# Altium schematic sheet motorEncoder.SchDoc
size A
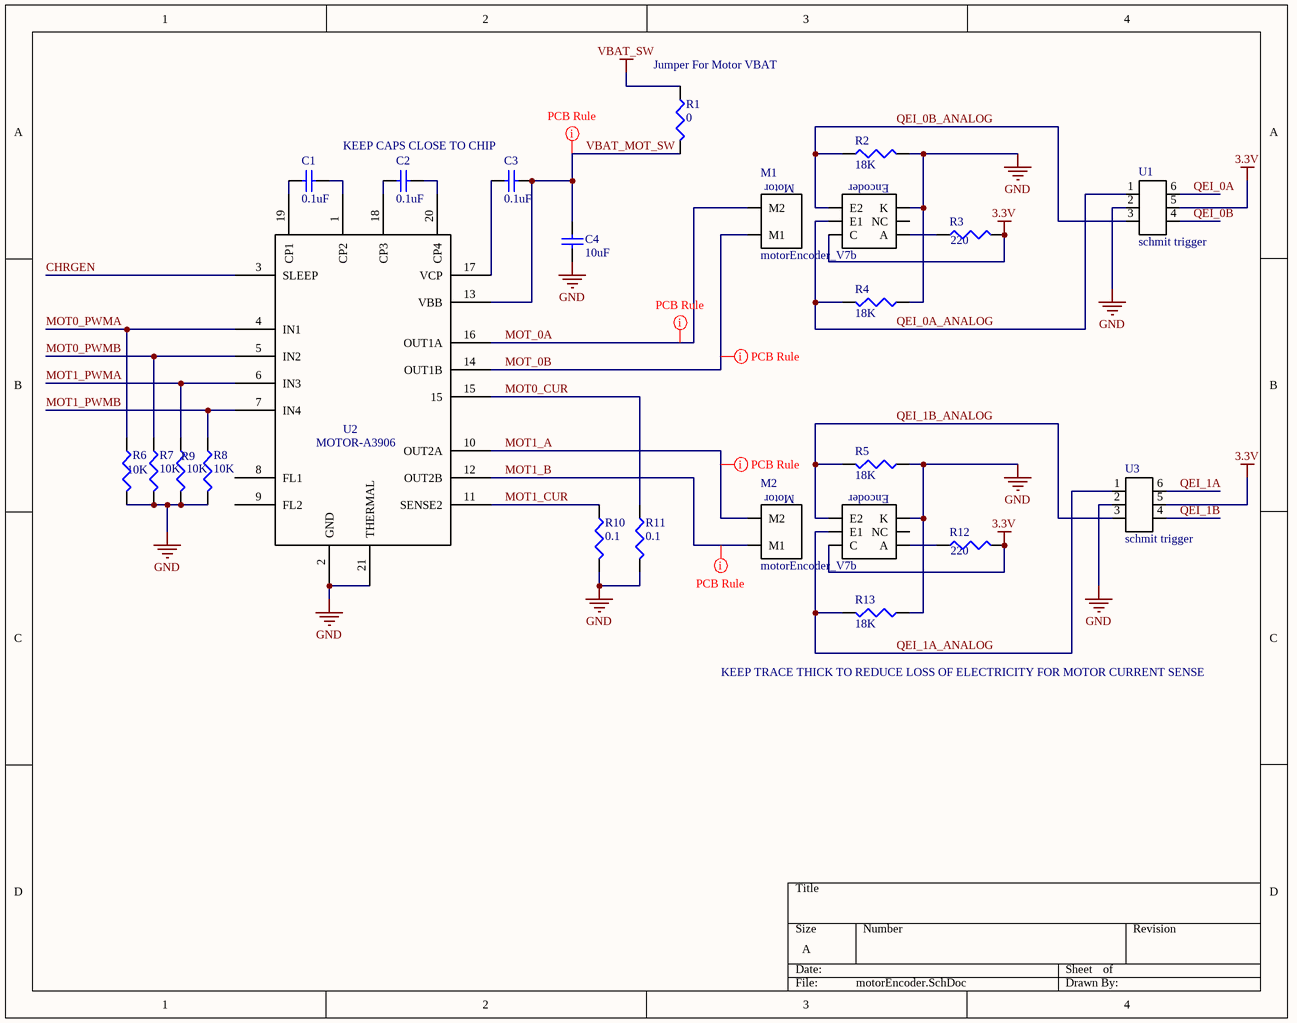
[diagram p0: motorEncoder.SchDoc]

## Parts
C1  value 0.1uF  [CAPC1005L]  (hidden comment: Cap Semi)
C2  value 0.1uF  [CAPC1005L]  (hidden comment: Cap Semi)
C3  value 0.1uF  [CAPC1005L]  (hidden comment: Cap Semi)
C4  value 10uF  [CAPC1608L]  (hidden comment: Cap Semi)
M1  motorEncoder_V7b  [motorEncoder_V7b]
M2  motorEncoder_V7b  [motorEncoder_V7b]
R1  value 0  [RESC3225L]  (hidden comment: Res3)
R2  value 18K  [RESC1608L]
R3  value 220  [RESC1608L]
R4  value 18K  [RESC1608L]
R5  value 18K  [RESC1608L]
R6  value 10K  [RESC1608L]  (hidden comment: Res3)
R7  value 10K  [RESC1608L]  (hidden comment: Res3)
R8  value 10K  [RESC1608L]  (hidden comment: Res3)
R9  value 10K  [RESC1608L]  (hidden comment: Res3)
R10  value 0.1  [RESC1608L]  (hidden comment: Res3)
R11  value 0.1  [RESC1608L]  (hidden comment: Res3)
R12  value 220  [RESC1608L]
R13  value 18K  [RESC1608L]
U1  schmit trigger  [DCK(R-PDSO-C6)]
U2  MOTOR-A3906  [QFN-20]
U3  schmit trigger  [DCK(R-PDSO-C6)]

## Nets
3.3V: M1.C M2.C R3.2 R12.2 U1.5 U3.5
GND: C4.1 M1.K M2.K R2.2 R4.1 R5.1 R6.2 R7.2 R8.2 R9.2 R10.2 R11.2 R13.1 U1.2 U2.2(GND) U2.21(THERMAL) U3.2
VBAT_SW: R1.1
CHRGEN: U2.3(SLEEP)
MOT0_CUR: R11.1 U2.15
MOT0_PWMA: R6.1 U2.4(IN1)
MOT0_PWMB: R7.1 U2.5(IN2)
MOT1_A: M2.M2 U2.10(OUT2A)
MOT1_B: M2.M1 U2.12(OUT2B)
MOT1_CUR: R10.1 U2.11(SENSE2)
MOT1_PWMA: R9.1 U2.6(IN3)
MOT1_PWMB: R8.1 U2.7(IN4)
MOT_0A: M1.M2 U2.16(OUT1A)
MOT_0B: M1.M1 U2.14(OUT1B)
QEI_0A: U1.6
QEI_0A_ANALOG: M1.E1 R4.2 U1.1
QEI_0B: U1.4
QEI_0B_ANALOG: M1.E2 R2.1 U1.3
QEI_1A: U3.6
QEI_1A_ANALOG: M2.E1 R13.2 U3.1
QEI_1B: U3.4
QEI_1B_ANALOG: M2.E2 R5.2 U3.3
VBAT_MOT_SW: C3.1 C4.2 R1.2 U2.13(VBB)
NetC1_1: C1.1 U2.19(CP1)
NetC1_2: C1.2 U2.1(CP2)
NetC2_1: C2.1 U2.18(CP3)
NetC2_2: C2.2 U2.20(CP4)
NetC3_2: C3.2 U2.17(VCP)
NetM1_A: M1.A R3.1
NetM2_A: M2.A R12.1

Not connected (* = marked no-connect by the designer): M1 NC; M2 NC; U2 8(FL1) 9(FL2)

## Layout directives
rule Width Constraint [Pref Width = 20mil    Min Width = 10mil    Max Width = 25mil]: MOT1_A, MOT1_B, MOT_0A, MOT_0B, VBAT_MOT_SW

## Notes on the sheet
- (near R1) Jumper For Motor VBAT
- KEEP CAPS CLOSE TO CHIP
- KEEP TRACE THICK TO REDUCE LOSS OF ELECTRICITY FOR MOTOR CURRENT SENSE
- (in symbol motorEncoder_V7b) Motor; Encoder

## Library data of the parts
C1-C4 = Cap Semi: Capacitor (Semiconductor SIM Model); Published: 8-Jun-2000; LatestRevisionDate: 29-May-2009; LatestRevisionNote: IPC-7351 Footprint Added.; PackageReference: C1206; Publisher: Altium Limited; PackageDescription: Chip Capacitor
R1-R13 = Res3: Resistor; Published: 8-Jun-2000; LatestRevisionDate: 29-May-2009; LatestRevisionNote: IPC-7351 Footprint Added.; PackageReference: J1-0603; Publisher: Altium Limited; PackageDescription: Chip Resistor